# Altium schematic sheet power_and_interface.SchDoc
size A4
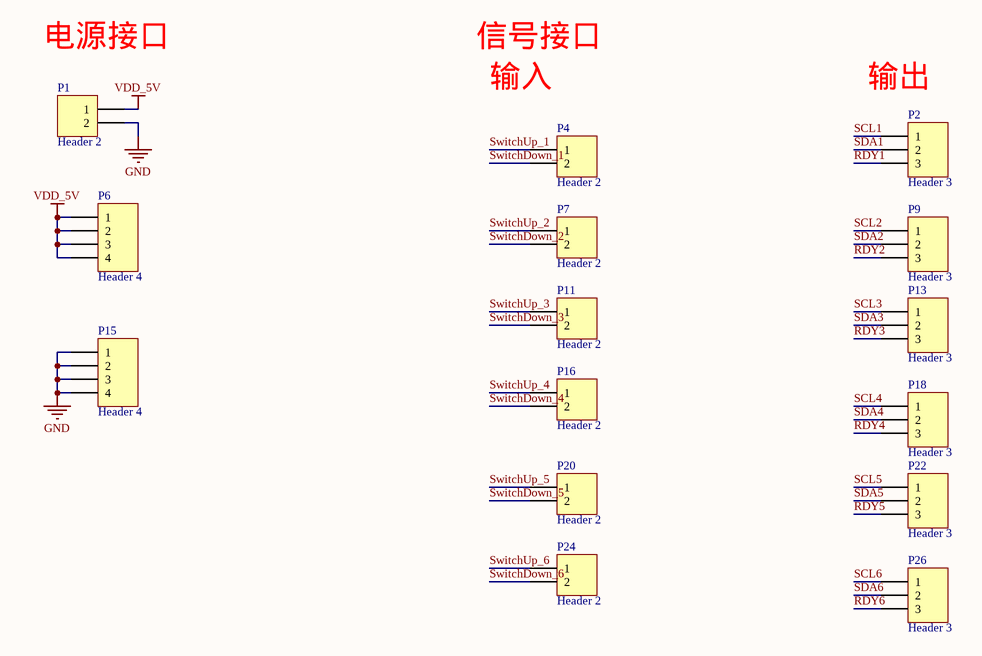
[diagram p0: power_and_interface.SchDoc]

## Parts
P1  Header 2  [XH2.54-LI-2P]
P2  Header 3  [XH2.0_3p]
P4  Header 2  [XH2.0_2p]
P6  Header 4  [HDR1X4]
P7  Header 2  [XH2.0_2p]
P9  Header 3  [XH2.0_3p]
P11  Header 2  [XH2.0_2p]
P13  Header 3  [XH2.0_3p]
P15  Header 4  [HDR1X4]
P16  Header 2  [XH2.0_2p]
P18  Header 3  [XH2.0_3p]
P20  Header 2  [XH2.0_2p]
P22  Header 3  [XH2.0_3p]
P24  Header 2  [XH2.0_2p]
P26  Header 3  [XH2.0_3p]

## Nets
GND: P1.2 P15.1 P15.2 P15.3 P15.4
VDD_5V: P1.1 P6.1 P6.2 P6.3 P6.4
RDY1: P2.3
RDY2: P9.3
RDY3: P13.3
RDY4: P18.3
RDY5: P22.3
RDY6: P26.3
SCL1: P2.1
SCL2: P9.1
SCL3: P13.1
SCL4: P18.1
SCL5: P22.1
SCL6: P26.1
SDA1: P2.2
SDA2: P9.2
SDA3: P13.2
SDA4: P18.2
SDA5: P22.2
SDA6: P26.2
SwitchDown_1: P4.2
SwitchDown_2: P7.2
SwitchDown_3: P11.2
SwitchDown_4: P16.2
SwitchDown_5: P20.2
SwitchDown_6: P24.2
SwitchUp_1: P4.1
SwitchUp_2: P7.1
SwitchUp_3: P11.1
SwitchUp_4: P16.1
SwitchUp_5: P20.1
SwitchUp_6: P24.1

## Notes on the sheet
- Labels drawn without touching a wire or pin: 信号接口, 电源接口, 输入, 输出

## Library data of the parts
P1 P4 P7 P11 P16 P20 P24 = Header 2: Header, 2-Pin; LatestRevisionDate: 17-Jul-2002; LatestRevisionNote: Re-released for DXP Platform.; Publisher: Altium Limited
P2 P9 P13 P18 P22 P26 = Header 3: Header, 3-Pin; LatestRevisionDate: 17-Jul-2002; LatestRevisionNote: Re-released for DXP Platform.; Publisher: Altium Limited
P6 P15 = Header 4: Header, 4-Pin; LatestRevisionDate: 17-Jul-2002; LatestRevisionNote: Re-released for DXP Platform.; Publisher: Altium Limited